# Altium schematic sheet p4b-power.SchDoc
size A; PageSetup: Record=PageOptions|CenterHorizontal=True|CenterVertical=True|PrintScale=1.11|XCorrection=1.00|YCorrection=1.00|PrintKind=0|BorderSize=5000000|LeftOffset=0|BottomOffset=0|Orientation=2|PaperLength=1000|PaperWidth=1000|Scale=100|PaperSource=7|PrintQuality=-3|MediaType=1|DitherType=10|PrintScaleMode=1|PaperKind=Letter|PaperIndex=1
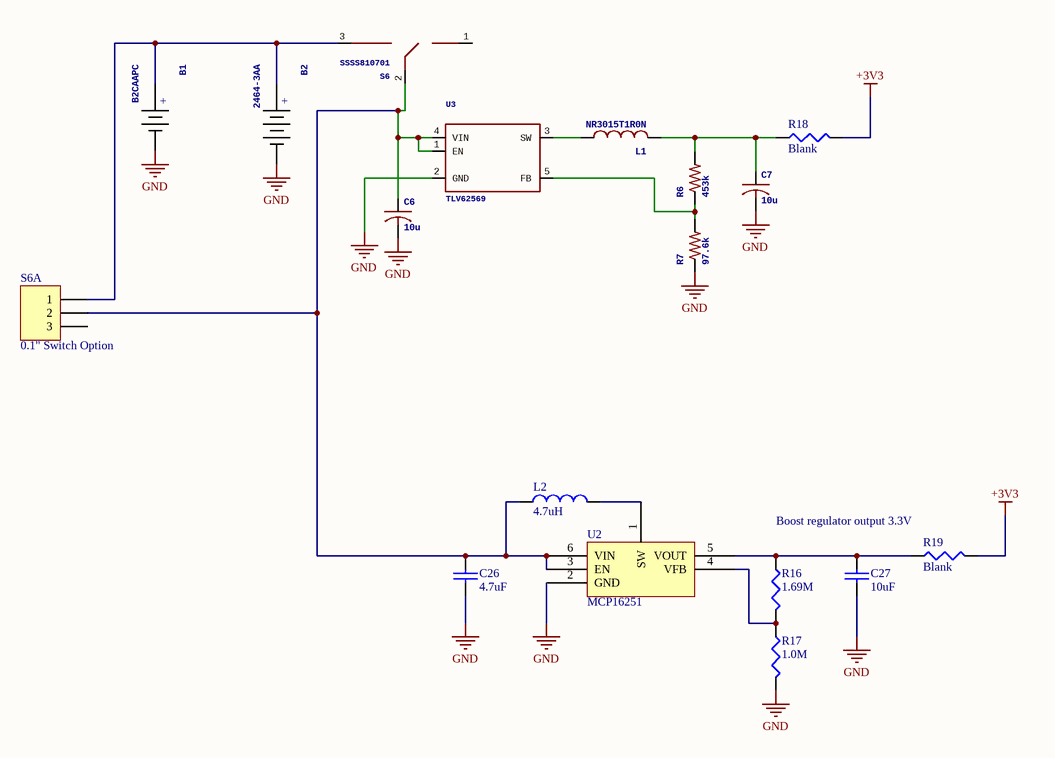
[diagram p0: p4b-power.SchDoc]

## Parts
B1  B2CAAPC  [B2CAAPC]
B2  2464-3AA  [2464-3AA]
C6  10u  [C0805]
C7  10u  [C0805]
C26  value 4.7uF  [C0805]  (hidden comment: VALUE)
C27  value 10uF  [C0805]  (hidden comment: VALUE)
L1  NR3015T1R0N  [NR3015]
L2  4.7uH  [WURTH-WE-TOC-2.8X2.8]
R6  453k  [R0603]
R7  97.6k  [R0603]
R16  1.69M  [R0603]
R17  1.0M  [R0603]
R18  Blank  [R0603]
R19  Blank  [R0603]
S6  SSSS810701  [SSSS810701]
S6A  0.1" Switch Option  [HDR1X3]
U2  MCP16251  [SOT23-6]
U3  TLV62569  [DBV-5]

## Nets
+3V3: R18.2(B) R19.2(B)
GND: B1.2(GND) B2.2(GND) C6.2 C7.2 C26.2(B) C27.2(B) R7.1 R17.2(B) U2.2(GND) U3.2(GND)
NetB1_1: B1.1(POS) B2.1(POS) S6.3 S6A.1
NetC6_1: C6.1 C26.1(A) L2.1 S6.2 S6A.2 U2.3(EN) U2.6(VIN) U3.1(EN) U3.4(VIN)
NetC7_1: C7.1 L1.2 R6.2 R18.1(A)
NetC27_1: C27.1(A) R16.1(A) R19.1(A) U2.5(VOUT)
NetL1_1: L1.1 U3.3(SW)
NetL2_2: L2.2 U2.1(SW)
NetR6_1: R6.1 R7.2 U3.5(FB)
NetR16_2: R16.2(B) R17.1(A) U2.4(VFB)

Not connected (* = marked no-connect by the designer): S6 1; S6A 3

## Notes on the sheet
- Boost regulator output 3.3V
- (in symbol 2464-3AA) +
- (in symbol B2CAAPC) +

## Library data of the parts
B1 = B2CAAPC: GateName_1: G$1; SymbolName_1: BATT-HOLDER; DeviceSetName: 12BH331P-GR; VENDOR: Digikey; LibraryName: badge; VALUE: B2CAAPC; VENDOR_PN: https://www.digikey.com/product-detail/en/mpd-memory-protection-devices/BC2AAPC/BC2AAPC-ND/455777
B2 = 2464-3AA: GateName_1: G$1; SymbolName_1: BATT-HOLDER; DeviceSetName: 12BH331P-GR; VENDOR: Digikey; LibraryName: badge; VALUE: 2464-3AA; VENDOR_PN: https://www.digikey.com/product-detail/en/keystone-electronics/2464/36-2464-ND/303813
C6 C7 = C-USC0805K: CAPACITOR, American symbol; MPN: JMK212BJ106KD-T; GateName_1: G$1; SymbolName_1: C-US; DeviceName: C0805K; LibraryName: rcl; DeviceSetName: C-US
C26 = CAP-4.7UF-0805: CAP, CER, 4.7UF, 6.3v, 10%, X5R, 0805
C27 = CAP-10UF-0805: CAP, CER, 10UF, 6.3v, 10%, X5R, 0805
L1 = NR3015: GateName_1: G$1; SymbolName_1: L-US; LibraryName: badge; DeviceSetName: NR3015
L2 = IND-4.7UH-SMD-2.8X2.8: IND, 4.7UH, SMD; VENDOR_PN: 732-1089-1-ND; VENDOR: Digikey; MFG: Wurth; MFG_PN: 744029004; VENDOR_LINK: https://www.digikey.com/product-detail/en/wurth-electronics-inc/744029004/732-1089-1-ND/1639150; VALUE: 4.7uH
R6 R7 = R-US_R0603: RESISTOR, American symbol; GateName_1: G$1; SymbolName_1: R-US; DeviceSetName: R-US_; DeviceName: R0603; LibraryName: rcl
R16 = RES-1.69M-0603: RES, 1.69M, 1/10W, 1%, 0603 SMD; VALUE: 1.69M
R17 = RES-1.0M-0603: RES, 1.0M, 1/10W, 1%, 0603 SMD; VALUE: 1.0M
R18 R19 = RES, BLANK, 0603: RES, BLANK OHM, 1/10W, 1%, 0603 SMD; VENDOR: Digikey; VALUE: Blank
S6 = SSSS810701: GateName_1: G$1; SymbolName_1: PWSW; LibraryName: badge; DeviceSetName: SSSS810701
S6A = Header 3: Header, 3-Pin; LatestRevisionDate: 17-Jul-2002; LatestRevisionNote: Re-released for DXP Platform.; Publisher: Altium Limited
U2 = MCP16251-SOT23-6: MCP16251, IC REG, BST 0.65A; MFG: Microchip; MFG_PN: MCP16251T-I/CH; VENDOR: Digikey; VENDOR_PN: MCP16251T-I/CHCT-ND; MFG_LINK: http://www.microchip.com/mymicrochip/filehandler.aspx?ddocname=en561096; VENDOR_LINK: https://www.digikey.com/product-detail/en/microchip-technology/MCP16251T-I-CH/MCP16251T-I-CHCT-ND/4277532; VALUE: MCP16251
U3 = TLV62569: GateName_1: G$1; SymbolName_1: TLV62569; LibraryName: badge; DeviceSetName: TLV62569